# Altium project AUDIO_UnitBoard.PrjPcb
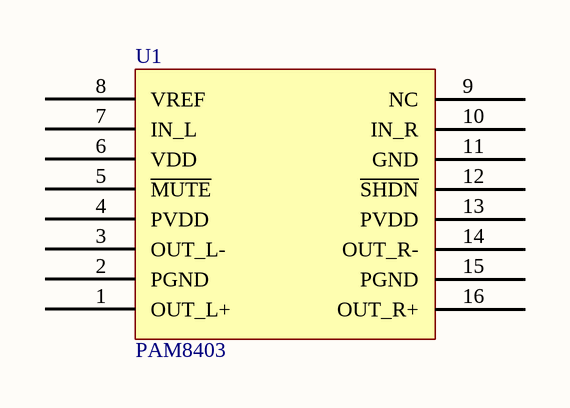
[diagram p0: Master.SchDoc]
1 sheet, 1 parts. Net scope: global (net labels, ports and power ports of the same name join across sheets).

## Sheet Master.SchDoc
size A4

### Parts
U1  PAM8403  [SOP_16]

### Nets

Not connected (* = marked no-connect by the designer): U1 1(OUT_L+) 2(PGND) 3(OUT_L-) 4(PVDD) 5(~{MUTE}) 6(VDD) 7(IN_L) 8(VREF) 9(NC) 10(IN_R) 11(GND) 12(~{SHDN}) 13(PVDD) 14(OUT_R-) 15(PGND) 16(OUT_R+)

### Library data of the parts
U1 = AUDIO AMP_PAM8403: Стереоусилитель класса D до 1.8 Вт при 8 Ом, или до 3.2 Вт при 4 Ом